# EAGLE schematic motoko_ice_dragon_x_bldc (EAGLE 9.6.0)
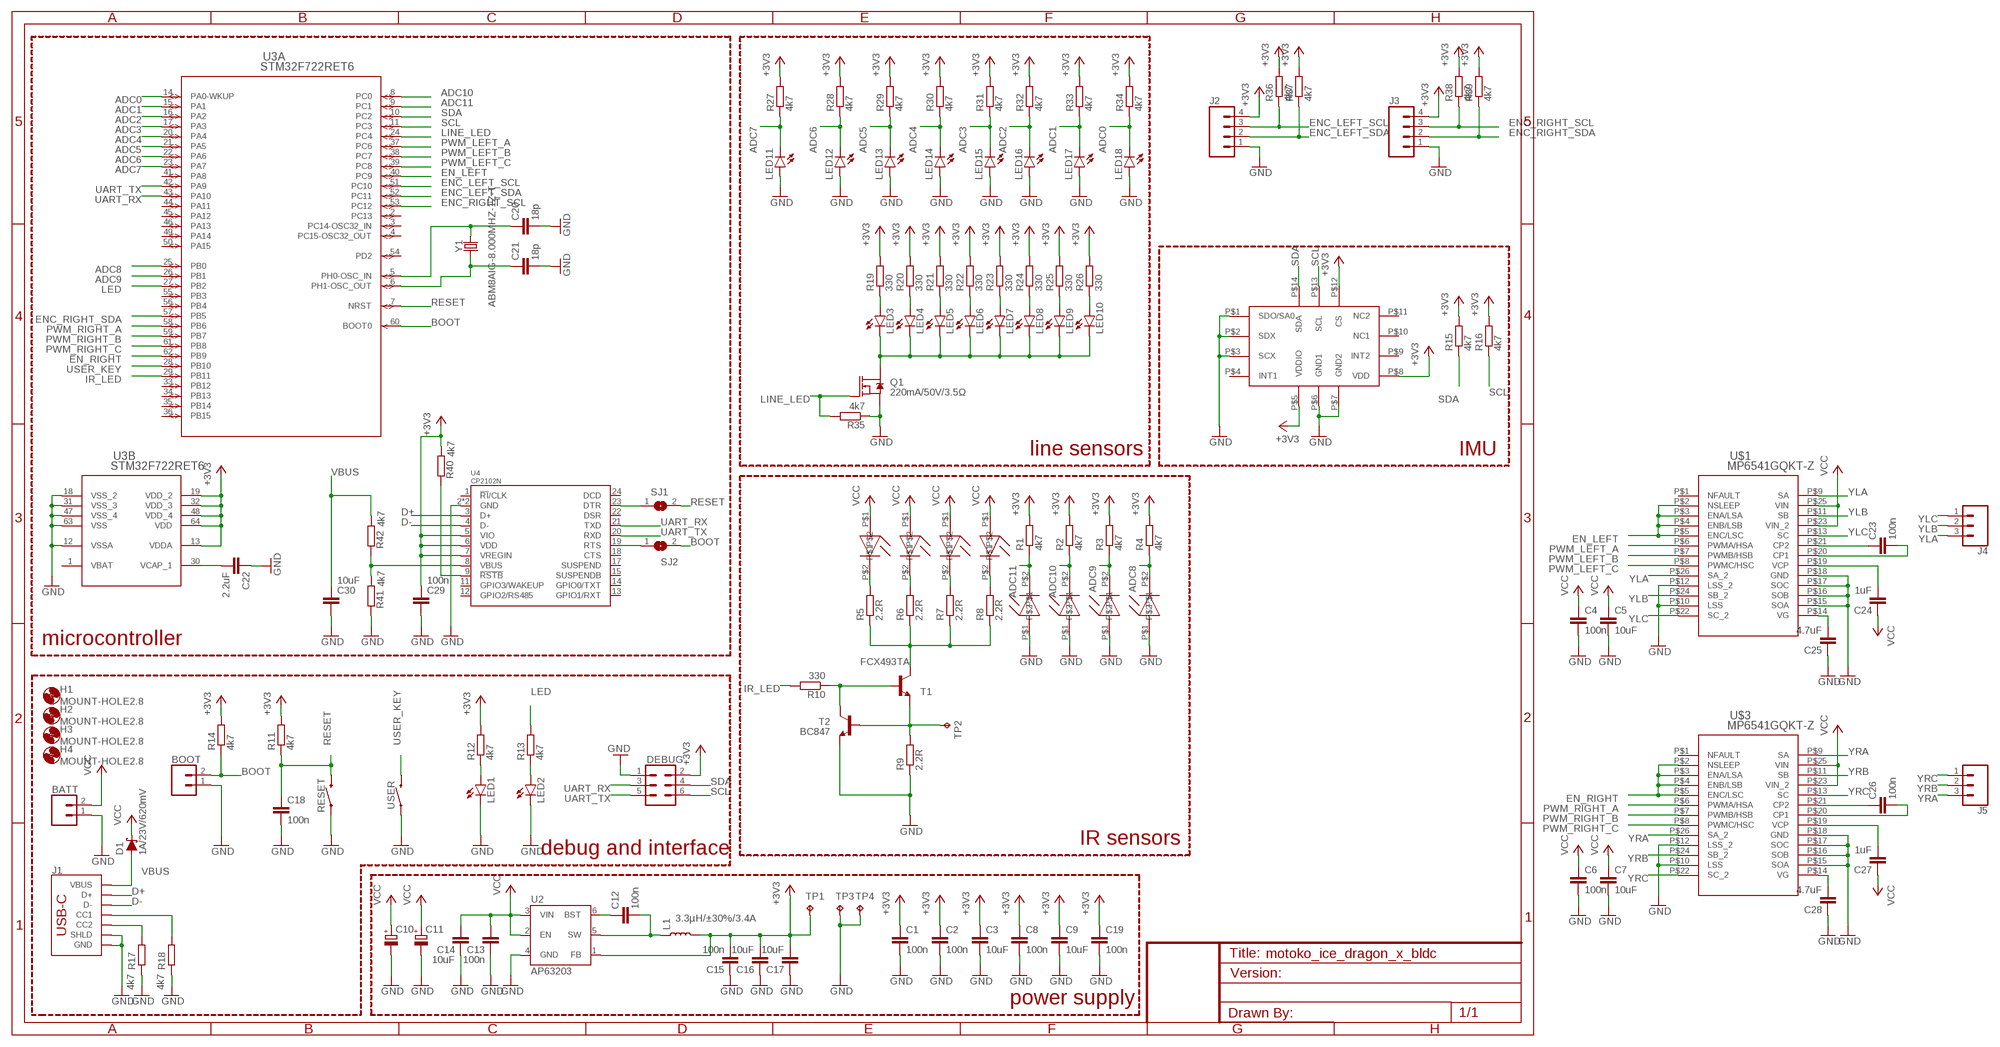
[diagram p0: schematic, sheet 1]

## Parts
BATT  CONN_02LOCK_LONGPADS  [1X02_LOCK_LONGPADS]
BOOT  CONN_02LOCK_LONGPADS  [1X02_LOCK_LONGPADS]
C1  100n  C-EUC0805  [C0805]
C2  100n  C-EUC0805  [C0805]
C3  10uF  C-EUC0805  [C0805]
C4  100n  C-EUC0805  [C0805]
C5  10uF  C-EUC0805  [C0805]
C6  100n  C-EUC0805  [C0805]
C7  10uF  C-EUC0805  [C0805]
C8  100n  C-EUC0805  [C0805]
C9  10uF  C-EUC0805  [C0805]
C10  CPOL-EU140CLH-0810  [140CLH-0810]
C11  CPOL-EU140CLH-0810  [140CLH-0810]
C12  100n  C-EUC0805  [C0805]
C13  100n  C-EUC0805  [C0805]
C14  10uF  C-EUC0805  [C0805]
C15  100n  C-EUC0805  [C0805]
C16  10uF  C-EUC0805  [C0805]
C17  10uF  C-EUC0805  [C0805]
C18  100n  C-EUC0805  [C0805]
C19  100n  C-EUC0805  [C0805]
C20  18p  C-EUC0805  [C0805]
C21  18p  C-EUC0805  [C0805]
C22  2.2uF  C-EUC0805  [C0805]
C23  100n  C-EUC0805  [C0805]
C24  1uF  C-EUC0805  [C0805]
C25  4.7uF  C-EUC0805  [C0805]
C26  100n  C-EUC0805  [C0805]
C27  1uF  C-EUC0805  [C0805]
C28  4.7uF  C-EUC0805  [C0805]
C29  100n  C-EUC0805  [C0805]
C30  10uF  C-EUC0805  [C0805]
D1  1A/23V/620mV  DIODE-SCHOTTKY-BAT20J  [SOD-323]
DEBUG  FEMALE 2x3  CONN_03X2FEMALE  [2X3]
H1  MOUNT-HOLE2.8  [2,8]
H2  MOUNT-HOLE2.8  [2,8]
H3  MOUNT-HOLE2.8  [2,8]
H4  MOUNT-HOLE2.8  [2,8]
J1  640-USB4105-GF-A-120, man. GCT  USB_C_2-LAYER_PADS  [USB-C-16P-2LAYER-PADS]
J2  CONN_04LONGPADS  [1X04_LONGPADS]
J3  CONN_04LONGPADS  [1X04_LONGPADS]
J4  CONN_03LONGPADS  [1X03_LONGPADS]
J5  CONN_03LONGPADS  [1X03_LONGPADS]
L1  3.3µH/±30%/3.4A  INDUCTOR-CR54-3.3UH  [CR54]
LED1  LEDCHIPLED_1206  [CHIPLED_1206]
LED2  LEDCHIPLED_1206  [CHIPLED_1206]
LED3  LEDCHIPLED_1206  [CHIPLED_1206]
LED4  LEDCHIPLED_1206  [CHIPLED_1206]
LED5  LEDCHIPLED_1206  [CHIPLED_1206]
LED6  LEDCHIPLED_1206  [CHIPLED_1206]
LED7  LEDCHIPLED_1206  [CHIPLED_1206]
LED8  LEDCHIPLED_1206  [CHIPLED_1206]
LED9  LEDCHIPLED_1206  [CHIPLED_1206]
LED10  LEDCHIPLED_1206  [CHIPLED_1206]
LED11  LEDCHIPLED_1206  [CHIPLED_1206]
LED12  LEDCHIPLED_1206  [CHIPLED_1206]
LED13  LEDCHIPLED_1206  [CHIPLED_1206]
LED14  LEDCHIPLED_1206  [CHIPLED_1206]
LED15  LEDCHIPLED_1206  [CHIPLED_1206]
LED16  LEDCHIPLED_1206  [CHIPLED_1206]
LED17  LEDCHIPLED_1206  [CHIPLED_1206]
LED18  LEDCHIPLED_1206  [CHIPLED_1206]
Q1  220mA/50V/3.5Ω  MOSFET-NCH-BSS138  [SOT23-3]
R1  4k7  R-EU_M0805  [M0805]
R2  4k7  R-EU_M0805  [M0805]
R3  4k7  R-EU_M0805  [M0805]
R4  4k7  R-EU_M0805  [M0805]
R5  2.2R  R-EU_M0805  [M0805]
R6  2.2R  R-EU_M0805  [M0805]
R7  2.2R  R-EU_M0805  [M0805]
R8  2.2R  R-EU_M0805  [M0805]
R9  2.2R  R-EU_M0805  [M0805]
R10  330  R-EU_M0805  [M0805]
R11  4k7  R-EU_M0805  [M0805]
R12  4k7  R-EU_M0805  [M0805]
R13  4k7  R-EU_M0805  [M0805]
R14  4k7  R-EU_M0805  [M0805]
R15  4k7  R-EU_M0805  [M0805]
R16  4k7  R-EU_M0805  [M0805]
R17  4k7  R-EU_M0805  [M0805]
R18  4k7  R-EU_M0805  [M0805]
R19  330  R-EU_M0805  [M0805]
R20  330  R-EU_M0805  [M0805]
R21  330  R-EU_M0805  [M0805]
R22  330  R-EU_M0805  [M0805]
R23  330  R-EU_M0805  [M0805]
R24  330  R-EU_M0805  [M0805]
R25  330  R-EU_M0805  [M0805]
R26  330  R-EU_M0805  [M0805]
R27  4k7  R-EU_M0805  [M0805]
R28  4k7  R-EU_M0805  [M0805]
R29  4k7  R-EU_M0805  [M0805]
R30  4k7  R-EU_M0805  [M0805]
R31  4k7  R-EU_M0805  [M0805]
R32  4k7  R-EU_M0805  [M0805]
R33  4k7  R-EU_M0805  [M0805]
R34  4k7  R-EU_M0805  [M0805]
R35  4k7  R-EU_M0805  [M0805]
R36  4k7  R-EU_M0805  [M0805]
R37  4k7  R-EU_M0805  [M0805]
R38  4k7  R-EU_M0805  [M0805]
R39  4k7  R-EU_M0805  [M0805]
R40  4k7  R-EU_M0805  [M0805]
R41  4k7  R-EU_M0805  [M0805]
R42  4k7  R-EU_M0805  [M0805]
RESET  MOMENTARY-SWITCH-SPST-SMD-6.2MM-TALL  [TACTILE_SWITCH_SMD_6.2MM_TALL]
SJ1  SJ  [SJ]
SJ2  SJ  [SJ]
T1  FCX493TA  -NPN-SOT89-BCE  [SOT89-BCE]
T2  BC847  [SOT23]
TP1  TPB1,27  [B1,27]
TP2  TPB1,27  [B1,27]
TP3  TPB1,27  [B1,27]
TP4  TPB1,27  [B1,27]
U2  AP63203  [SOT23-6]
U3  STM32F722RET6  [LQFP64-10X10MM]
U4  CP2102N  [QFN24]
U$1  MP6541GQKT-Z  [TQFN-26]
U$3  MP6541GQKT-Z  [TQFN-26]
U$6  LSM6DSM  [LGA14L]
U$7  LED_5MM_AXIAL  [LED_5MM_AXIAL]
U$8  LED_5MM_AXIAL  [LED_5MM_AXIAL]
U$9  LED_5MM_AXIAL  [LED_5MM_AXIAL]
U$10  LED_5MM_AXIAL  [LED_5MM_AXIAL]
U$11  LED_5MM_AXIAL  [LED_5MM_AXIAL]
U$12  LED_5MM_AXIAL  [LED_5MM_AXIAL]
U$13  LED_5MM_AXIAL  [LED_5MM_AXIAL]
U$14  LED_5MM_AXIAL  [LED_5MM_AXIAL]
USER  MOMENTARY-SWITCH-SPST-SMD-6.2MM-TALL  [TACTILE_SWITCH_SMD_6.2MM_TALL]
Y1  ABM8AIG-8.000MHZ-1Z-T  CRYSTALSMD-3.2X2.5  [CRYSTAL-SMD-3.2X2.5MM]

## Nets
+3V3: C1.1 C2.1 C3.1 C8.1 C9.1 C15.2 C16.2 C17.2 C19.1 C29.1 DEBUG.2 J2.4 J3.4 L1.P$2 R1.2 R2.2 R3.2 R4.2 R11.2 R12.2 R14.2 R15.2 R16.2 R19.2 R20.2 R21.2 R22.2 R23.2 R24.2 R25.2 R26.2 R27.2 R28.2 R29.2 R30.2 R31.2 R32.2 R33.2 R34.2 R36.2 R37.2 R38.2 R39.2 R40.1 TP1.TP U2.1(FB) U3.13(B:VDDA) U3.19(B:VDD_2) U3.32(B:VDD_3) U3.48(B:VDD_4) U3.64(B:VDD) U4.5(VIO) U4.6(VDD) U4.7(VREGIN) U$6.P$5(VDDIO) U$6.P$8(VDD) U$6.P$12(CS)
ADC0: LED18.C R34.1 U3.14(A:PA0-WKUP)
ADC1: LED17.C R33.1 U3.15(A:PA1)
ADC2: LED16.C R32.1 U3.16(A:PA2)
ADC3: LED15.C R31.1 U3.17(A:PA3)
ADC4: LED14.C R30.1 U3.20(A:PA4)
ADC5: LED13.C R29.1 U3.21(A:PA5)
ADC6: LED12.C R28.1 U3.22(A:PA6)
ADC7: LED11.C R27.1 U3.23(A:PA7)
ADC8: R4.1 U3.25(A:PB0) U$7.P$2
ADC9: R3.1 U3.26(A:PB1) U$11.P$2
ADC10: R2.1 U3.8(A:PC0) U$14.P$2
ADC11: R1.1 U3.9(A:PC1) U$9.P$2
BOOT: BOOT.2 R14.1 SJ2.2 U3.60(A:BOOT0)
D+: J1.A6(D+) J1.B6(D+) U4.3(D+)
D-: J1.A7(D-) J1.B7(D-) U4.4(D-)
EN_LEFT: U3.40(A:PC9) U$1.P$2(NSLEEP) U$1.P$3(ENA/LSA) U$1.P$4(ENB/LSB) U$1.P$5(ENC/LSC)
EN_RIGHT: U3.62(A:PB9) U$3.P$2(NSLEEP) U$3.P$3(ENA/LSA) U$3.P$4(ENB/LSB) U$3.P$5(ENC/LSC)
ENC_LEFT_SCL: J2.3 R36.1 U3.51(A:PC10)
ENC_LEFT_SDA: J2.2 R37.1 U3.52(A:PC11)
ENC_RIGHT_SCL: J3.3 R38.1 U3.53(A:PC12)
ENC_RIGHT_SDA: J3.2 R39.1 U3.57(A:PB5)
GND: BATT.1 BOOT.1 C1.2 C2.2 C3.2 C4.2 C5.2 C6.2 C7.2 C8.2 C9.2 C10.- C11.- C13.1 C14.1 C15.1 C16.1 C17.1 C18.2 C19.2 C20.2 C21.2 C22.1 C25.1 C28.1 C29.2 C30.2 DEBUG.1 J1.GND J1.GND2(GND) J1.SHLD1(SHLD) J1.SHLD2(SHLD) J1.SHLD3(SHLD) J1.SHLD4(SHLD) J2.1 J3.1 LED1.C LED2.C LED11.A LED12.A LED13.A LED14.A LED15.A LED16.A LED17.A LED18.A Q1.2(S) R9.1 R17.1 R18.1 R35.1 R41.2 RESET.A2 T2.2(E) TP3.TP TP4.TP U2.4(GND) U3.12(B:VSSA) U3.18(B:VSS_2) U3.31(B:VSS_3) U3.47(B:VSS_4) U3.63(B:VSS) U4.2(GND) U4.PAD(GND) U$1.P$10(LSS) U$1.P$12(LSS_2) U$1.P$15(SOA) U$1.P$16(SOB) U$1.P$17(SOC) U$1.P$18(GND) U$3.P$10(LSS) U$3.P$12(LSS_2) U$3.P$15(SOA) U$3.P$16(SOB) U$3.P$17(SOC) U$3.P$18(GND) U$6.P$1(SDO/SA0) U$6.P$2(SDX) U$6.P$3(SCX) U$6.P$6(GND1) U$6.P$7(GND2) U$7.P$1 U$9.P$1 U$11.P$1 U$14.P$1 USER.A2
IR_LED: R10.2 U3.29(A:PB11)
LED: R13.2 U3.27(A:PB2)
LINE_LED: Q1.1(G) R35.2 U3.24(A:PC4)
N$1: C23.1 U$1.P$21(CP2)
N$2: C23.2 U$1.P$20(CP1)
N$3: C24.2 U$1.P$19(VCP)
N$4: C25.2 U$1.P$14(VG)
N$5: R5.2 U$10.P$2
N$6: R6.2 U$13.P$2
N$7: R7.2 U$12.P$2
N$8: R8.2 U$8.P$2
N$10: R9.2 T1.E T2.1(B) TP2.TP
N$11: J1.B5(CC2) R17.2
N$12: C12.1 U2.6(BST)
N$13: C12.2 L1.P$1 U2.5(SW)
N$14: R10.1 T1.B T2.3(C)
N$15: R5.1 R6.1 R7.1 R8.1 T1.C
N$16: LED1.A R12.1
N$17: LED2.A R13.1
N$18: J1.A5(CC1) R18.2
N$19: C20.1 U3.5(A:PH0-OSC_IN) Y1.3
N$20: C21.1 U3.6(A:PH1-OSC_OUT) Y1.1
N$21: LED3.A R19.1
N$22: LED4.A R20.1
N$23: C22.2 U3.30(B:VCAP_1)
N$24: LED5.A R21.1
N$25: LED6.A R22.1
N$26: LED7.A R23.1
N$27: LED8.A R24.1
N$28: LED9.A R25.1
N$29: LED10.A R26.1
N$30: LED3.C LED4.C LED5.C LED6.C LED7.C LED8.C LED9.C LED10.C Q1.3(D)
N$31: C26.1 U$3.P$21(CP2)
N$32: C26.2 U$3.P$20(CP1)
N$33: SJ1.1 U4.23(DTR)
N$34: SJ2.1 U4.19(RTS)
N$35: C27.2 U$3.P$19(VCP)
N$36: C28.2 U$3.P$14(VG)
N$37: R40.2 U4.9(!RSTB)
N$38: R41.1 R42.2 U4.8(VBUS)
PWM_LEFT_A: U3.37(A:PC6) U$1.P$6(PWMA/HSA)
PWM_LEFT_B: U3.38(A:PC7) U$1.P$7(PWMB/HSB)
PWM_LEFT_C: U3.39(A:PC8) U$1.P$8(PWMC/HSC)
PWM_RIGHT_A: U3.58(A:PB6) U$3.P$6(PWMA/HSA)
PWM_RIGHT_B: U3.59(A:PB7) U$3.P$7(PWMB/HSB)
PWM_RIGHT_C: U3.61(A:PB8) U$3.P$8(PWMC/HSC)
RESET: C18.1 R11.1 RESET.B2 SJ1.2 U3.7(A:NRST)
SCL: DEBUG.6 R16.1 U3.11(A:PC3) U$6.P$13(SCL)
SDA: DEBUG.4 R15.1 U3.10(A:PC2) U$6.P$14(SDA)
UART_RX: DEBUG.3 U3.43(A:PA10) U4.21(TXD)
UART_TX: DEBUG.5 U3.42(A:PA9) U4.20(RXD)
USER_KEY: U3.28(A:PB10) USER.B2
VBUS: C30.1 D1.A J1.VBUS1(VBUS) J1.VBUS2(VBUS) R42.1
VCC: BATT.2 C4.1 C5.1 C6.1 C7.1 C10.+ C11.+ C13.2 C14.2 C24.1 C27.1 D1.C U2.2(EN) U2.3(VIN) U$1.P$23(VIN_2) U$1.P$25(VIN) U$3.P$23(VIN_2) U$3.P$25(VIN) U$8.P$1 U$10.P$1 U$12.P$1 U$13.P$1
YLA: J4.3 U$1.P$9(SA) U$1.P$26(SA_2)
YLB: J4.2 U$1.P$11(SB) U$1.P$24(SB_2)
YLC: J4.1 U$1.P$13(SC) U$1.P$22(SC_2)
YRA: J5.3 U$3.P$9(SA) U$3.P$26(SA_2)
YRB: J5.2 U$3.P$11(SB) U$3.P$24(SB_2)
YRC: J5.1 U$3.P$13(SC) U$3.P$22(SC_2)
Unconnected: U3.2(A:PC13) U3.3(A:PC14-OSC32_IN) U3.4(A:PC15-OSC32_OUT) U3.33(A:PB12) U3.34(A:PB13) U3.35(A:PB14) U3.36(A:PB15) U3.41(A:PA8) U3.44(A:PA11) U3.45(A:PA12) U3.46(A:PA13) U3.49(A:PA14) U3.50(A:PA15) U3.54(A:PD2) U3.55(A:PB3) U3.56(A:PB4) U4.1(!RI!/CLK) U4.11(GPIO3/WAKEUP) U4.12(GPIO2/RS485) U4.13(GPIO1/RXT) U4.14(GPIO0/TXT) U4.15(SUSPENDB) U4.17(SUSPEND) U4.18(CTS) U4.22(DSR) U4.24(DCD) U$1.P$1(NFAULT) U$3.P$1(NFAULT) U$6.P$4(INT1) U$6.P$9(INT2) U$6.P$10(NC1) U$6.P$11(NC2)

## Notes on the sheet
- line sensors | IMU
- microcontroller
- IR sensors
- debug and interface
- power supply

## Power pins joined to a net without a drawn wire
VBAT: U3.1(B:VBAT)

## Library data of the parts
BATT BOOT = SparkFun-Connectors:CONN_02: Multi connection point. Often used as Generic Header-pin footprint for 0.1 inch spaced/style header connections On any of the 0.1 inch spaced packages, you can populate with these: Break Away Headers - Straight <https://www.sparkfun.com/products/116> (PRT-00116) Break Away Male Headers - Right Angle <https://www.sparkfun.com/products/553> (PRT-00553) Female Headers <https://www.sparkfun.com/products/115> (PRT-00115) Break Away Headers - Machine Pin <https://www.sparkfun.com/products/117> (PRT-00117) Break Away Female Headers - Swiss Machine Pin <https://www.sparkfun.com/products/743> (PRT-00743) For SCREWTERMINALS and SPRING TERMINALS visit here: Screw Terimnals on SparkFun.com <https://www.sparkfun.com/search/results?term=Screw+Terminals> (5mm/3.5mm/2.54mm spacing) This device is also useful as a general connection point to wire up your design to another part of your project. Our various solder wires solder well into these plated through hole pads. Hook-Up Wire - Assortment (Stranded, 22 AWG) <https://www.sparkfun.com/products/11375> (PRT-11375) Hook-Up Wire - Assortment (Solid Core, 22 AWG) <https://www.sparkfun.com/products/11367> (PRT-11367) View the entire wire category on our website here <https://www.sparkfun.com/categories/141> Special notes: Molex polarized connector foot print use with: PRT-08233 with associated crimp pins and housings. 2.54_SCREWTERM for use with PRT-10571. 3.5mm Screw Terminal footprints for PRT-08084 5mm Screw Terminal footprints for use with PRT-08432
C1-C9 C12-C30 = rcl:C-EU: CAPACITOR, European symbol; SPICEPREFIX: C
C10 C11 = rcl:CPOL-EU: POLARIZED CAPACITOR, European symbol; SPICEPREFIX: C
D1 = SparkFun-DiscreteSemi:DIODE-SCHOTTKY: Schottky diode A Schottky diode is a semiconductor diode which has a low forward voltage drop and a very fast switching action.; PROD_ID: DIO-11623
DEBUG = SparkFun-Connectors:CONN_03X2: Multi connection point. Often used as Generic Header-pin footprint for 0.1 inch spaced/style header connections You can populate with any combo of single row headers, but if you'd like an exact match, check these: Header - 2x3 (Male, 0.1") <https://www.sparkfun.com/products/12807> (PRT-12807) Header - 2x3 (Female, 0.1") <https://www.sparkfun.com/products/13010> (PRT-13010) 2x3 Pin Shrouded Header <https://www.sparkfun.com/products/10877> (PRT-10877) On any of the 0.1 inch spaced packages, you can populate with these: Break Away Headers - Straight <https://www.sparkfun.com/products/116> (PRT-00116) Break Away Male Headers - Right Angle <https://www.sparkfun.com/products/553> (PRT-00553) Female Headers <https://www.sparkfun.com/products/115> (PRT-00115) Break Away Headers - Machine Pin <https://www.sparkfun.com/products/117> (PRT-00117) Break Away Female Headers - Swiss Machine Pin <https://www.sparkfun.com/products/743> (PRT-00743) Special note: the shrouded connector mates well with our 3x2 ribbon cables: Ribbon Crimp Connector - 6-pin (2x3, Female) <https://www.sparkfun.com/products/10651> (PRT-10651) Ribbon Cable - 6 wire (15ft) <https://www.sparkfun.com/products/10646> (PRT-10646); PROD_ID: CONN-11566
H1-H4 = holes:MOUNT-HOLE: MOUNTING HOLE with drill center marker
J1 = SparkFun-Connectors:USB_C: USB Type C 16Pin Connector Super Speed pins not available on the 16-pin purely SMD connector so this part is best for USB 2.0 implementations. D1 and D2 are tied together enabling D+/- no matter which way the cable is plugged into the connector. The two channel configuration pins (CC1/2) are exposed. These are normally connected to ground via 5.1k resistors but can be reconfigured for high current/high power applications.; PROD_ID: CONN-14122
J2 J3 = SparkFun-Connectors:CONN_04: Multi connection point. Often used as Generic Header-pin footprint for 0.1 inch spaced/style header connections On any of the 0.1 inch spaced packages, you can populate with these: Break Away Headers - Straight <https://www.sparkfun.com/products/116> (PRT-00116) Break Away Male Headers - Right Angle <https://www.sparkfun.com/products/553> (PRT-00553) Female Headers <https://www.sparkfun.com/products/115> (PRT-00115) Break Away Headers - Machine Pin <https://www.sparkfun.com/products/117> (PRT-00117) Break Away Female Headers - Swiss Machine Pin <https://www.sparkfun.com/products/743> (PRT-00743) For SCREWTERMINALS and SPRING TERMINALS visit here: Screw Terimnals on SparkFun.com <https://www.sparkfun.com/search/results?term=Screw+Terminals> (5mm/3.5mm/2.54mm spacing) This device is also useful as a general connection point to wire up your design to another part of your project. Our various solder wires solder well into these plated through hole pads. Hook-Up Wire - Assortment (Stranded, 22 AWG) <https://www.sparkfun.com/products/11375> (PRT-11375) Hook-Up Wire - Assortment (Solid Core, 22 AWG) <https://www.sparkfun.com/products/11367> (PRT-11367) View the entire wire category on our website here <https://www.sparkfun.com/categories/141> Special notes: Molex polarized connector foot print use with SKU : PRT-08231 with associated crimp pins and housings. 1MM SMD Version SKU: PRT-10208; PROD_ID: CONN-09696
J4 J5 = SparkFun-Connectors:CONN_03: Multi connection point. Often used as Generic Header-pin footprint for 0.1 inch spaced/style header connections On any of the 0.1 inch spaced packages, you can populate with these: Break Away Headers - Straight <https://www.sparkfun.com/products/116> (PRT-00116) Break Away Male Headers - Right Angle <https://www.sparkfun.com/products/553> (PRT-00553) Female Headers <https://www.sparkfun.com/products/115> (PRT-00115) Break Away Headers - Machine Pin <https://www.sparkfun.com/products/117> (PRT-00117) Break Away Female Headers - Swiss Machine Pin <https://www.sparkfun.com/products/743> (PRT-00743) Stackable Header - 3 Pin (Female, 0.1") <https://www.sparkfun.com/products/13875> (PRT-13875) For SCREWTERMINALS and SPRING TERMINALS visit here: Screw Terimnals on SparkFun.com <https://www.sparkfun.com/search/results?term=Screw+Terminals> (5mm/3.5mm/2.54mm spacing) This device is also useful as a general connection point to wire up your design to another part of your project. Our various solder wires solder well into these plated through hole pads. Hook-Up Wire - Assortment (Stranded, 22 AWG) <https://www.sparkfun.com/products/11375> (PRT-11375) Hook-Up Wire - Assortment (Solid Core, 22 AWG) <https://www.sparkfun.com/products/11367> (PRT-11367) View the entire wire category on our website here <https://www.sparkfun.com/categories/141> Special notes: Molex polarized connector foot print use with SKU : PRT-08232 with associated crimp pins and housings.
L1 = SparkFun-Coils:INDUCTOR: Inductors Resist changes in electrical current. Basically a coil of wire. SparkFun Products: SparkFun Load Cell Amplifier - HX711 <https://www.sparkfun.com/products/13879> IOIO-OTG - V2.2 <https://www.sparkfun.com/products/13613>; PROD_ID: NDUC-11157
LED1-LED18 = led:LED: LED OSRAM: - CHIPLED LG R971, LG N971, LY N971, LG Q971, LY Q971, LO R971, LY R971 LH N974, LH R974 LS Q976, LO Q976, LY Q976 LO Q996 - Hyper CHIPLED LW Q18S LB Q993, LB Q99A, LB R99A - SideLED LS A670, LO A670, LY A670, LG A670, LP A670 LB A673, LV A673, LT A673, LW A673 LH A674 LY A675 LS A676, LA A676, LO A676, LY A676, LW A676 LS A679, LY A679, LG A679 - Hyper Micro SIDELED® LS Y876, LA Y876, LO Y876, LY Y876 LT Y87S - SmartLED LW L88C, LW L88S LB L89C, LB L89S, LG L890 LS L89K, LO L89K, LY L89K LS L896, LA L896, LO L896, LY L896 - TOPLED LS T670, LO T670, LY T670, LG T670, LP T670 LSG T670, LSP T670, LSY T670, LOP T670, LYG T670 LG T671, LOG T671, LSG T671 LB T673, LV T673, LT T673, LW T673 LH T674 LS T676, LA T676, LO T676, LY T676, LB T676, LH T676, LSB T676, LW T676 LB T67C, LV T67C, LT T67C, LS T67K, LO T67K, LY T67K, LW E67C LS E67B, LA E67B, LO E67B, LY E67B, LB E67C, LV E67C, LT E67C LW T67C LS T679, LY T679, LG T679 LS T770, LO T770, LY T770, LG T770, LP T770 LB T773, LV T773, LT T773, LW T773 LH T774 LS E675, LA E675, LY E675, LS T675 LS T776, LA T776, LO T776, LY T776, LB T776 LHGB T686 LT T68C, LB T68C - Hyper Mini TOPLED® LB M676 - Mini TOPLED Santana® LG M470 LS M47K, LO M47K, LY M47K Source: http://www.osram.convergy.de LUXEON: - LUMILED® LXK2-PW12-R00, LXK2-PW12-S00, LXK2-PW14-U00, LXK2-PW14-V00 LXK2-PM12-R00, LXK2-PM12-S00, LXK2-PM14-U00 LXK2-PE12-Q00, LXK2-PE12-R00, LXK2-PE12-S00, LXK2-PE14-T00, LXK2-PE14-U00 LXK2-PB12-K00, LXK2-PB12-L00, LXK2-PB12-M00, LXK2-PB14-N00, LXK2-PB14-P00, LXK2-PB14-Q00 LXK2-PR12-L00, LXK2-PR12-M00, LXK2-PR14-Q00, LXK2-PR14-R00 LXK2-PD12-Q00, LXK2-PD12-R00, LXK2-PD12-S00 LXK2-PH12-R00, LXK2-PH12-S00 LXK2-PL12-P00, LXK2-PL12-Q00, LXK2-PL12-R00 Source: www.luxeon.com KINGBRIGHT: KA-3528ASYC Source: www.kingbright.com
Q1 = SparkFun-DiscreteSemi:MOSFET-NCH: N-channel MOSFETs Voltage controlled devices that allow control of high current outputs. SparkFun Products: SparkFun OpenScale <https://www.sparkfun.com/products/13261> SparkFun Digital Sandbox <https://www.sparkfun.com/products/12651> SparkFun Monster Moto Shield <https://www.sparkfun.com/products/10182> SparkFun MOSFET Power Controller <https://www.sparkfun.com/products/11214>; PROD_ID: TRANS-00830
R1-R42 = rcl:R-EU_: RESISTOR, European symbol; SPICEPREFIX: R
RESET USER = SparkFun-Switches:MOMENTARY-SWITCH-SPST: Momentary Switch (Pushbutton) - SPST Normally-open (NO) SPST momentary switches (buttons, pushbuttons). Variants PTH-12MM - 12mm square, through-hole Momentary Pushbutton Switch - 12mm Square <https://www.sparkfun.com/products/9190> (COM-09190) PTH-6.0MM, PTH-6.0MM-KIT - 6.0mm square, through-hole Mini Pushbutton Switch <https://www.sparkfun.com/products/97> (COM-00097) KIT package intended for soldering kit's - only one side of pads' copper is exposed. PTH-RIGHT-ANGLE-KIT - Right-angle, through-hole Right Angle Tactile Button <https://www.sparkfun.com/products/10791> - Used on SparkFun BigTime Watch Kit <https://www.sparkfun.com/products/11734> SMD-12MM - 12mm square, surface-mount Tactile Button - SMD (12mm) <https://www.sparkfun.com/products/12993> (COM-12993) Used on SparkFun PicoBoard <https://www.sparkfun.com/products/11888> SMD-4.5MM - 4.5mm Square Trackball Switch Used on SparkFun Blackberry Trackballer Breakout <https://www.sparkfun.com/products/13169> SMD-4.6MMX2.8MM - 4.60mm x 2.80mm, surface mount Used on SparkFun SAMD21 Mini Breakout <https://www.sparkfun.com/products/13664> SMD-5.2MM, SMD-5.2-REDUNDANT - 5.2mm square, surface-mount Mini Pushbutton Switch - SMD <https://www.sparkfun.com/products/8720> (COM-08720) Used on Arduino Pro Mini <https://www.sparkfun.com/products/11114> REDUNDANT package connects both switch circuits together SMD-6.0X3.5MM - 6.0 x 3.5mm, surface mount Momentary Reset Switch SMD <https://www.sparkfun.com/products/8229> (COM-08229) SMD-6.2MM-TALL - 6.2mm square, surface mount Tactile Button - SMD (6mm) <https://www.sparkfun.com/products/12992> Used on SparkFun Digital Sandbox <https://www.sparkfun.com/products/12651> SMD-RIGHT-ANGLE - Right-angle, surface mount Used on SparkFun Block for Intel® Edison - Arduino <https://www.sparkfun.com/products/13036>; PROD_ID: SWCH-11966; SF_SKU: COM-12992
SJ1 SJ2 = jumper:SJ: SMD solder JUMPER
T1 = transistor:*-NPN-: NPN Transistror BF959 corrected 2008.03.06
T2 = transistor-neu-to92:BC847: NPN TRANSISTOR
TP1-TP4 = testpad:TP: Test pad
U2 = SparkFun-IC-Power:AP63203: Diodes Inc. AP63203 3.8V-32V input 3.3V Buck The AP63200/AP63201/AP63203/AP63205 is a 2A, synchronous buck converter with a wide input voltage range of 3.8V to 32V and fully integrates a 125mΩ high-side power MOSFET and a 68mΩ lowside power MOSFET to provide high-efficiency step-down DC/DC conversion; PROD_ID: VREG-15244
U3 = my_library:STM32F722RET6; COPYRIGHT: Copyright (C) 2024 Ultra Librarian. All rights reserved.; MANUFACTURER_PART_NUMBER: STM32F722RET6; MFR_NAME: STMicroelectronics
U4 = SparkFun-IC-Comms:CP2102N; PROD_ID: IC-14020
U$1 U$3 = my_library:MP6541GQKT-Z: 3 phase brushless driver, 40V, 8A, MP6541 : 3xPWM + 3xENABLE inputs MP6541A : 6xPWM (oposite pahses) prefer MP6541A with PWM and ENABLE inputs (requires inly 3 PWM channels) https://www.monolithicpower.com/en/mp6541.html
U$6 = my_library:LSM6DSM
U$7-U$11 U$13 U$14 = my_library:LED_5MM_AXIAL
U$12 = my_library:LED_5MM_AXIAL; SPICEPREFIX: B
Y1 = SparkFun-Clocks:CRYSTAL: Crystals (Generic) These are passive quartz crystals, which can be used as a clock source for a microcontroller. Crystal's are two-terminal devices. They require external "load" capacitors to generate an oscillating signal.